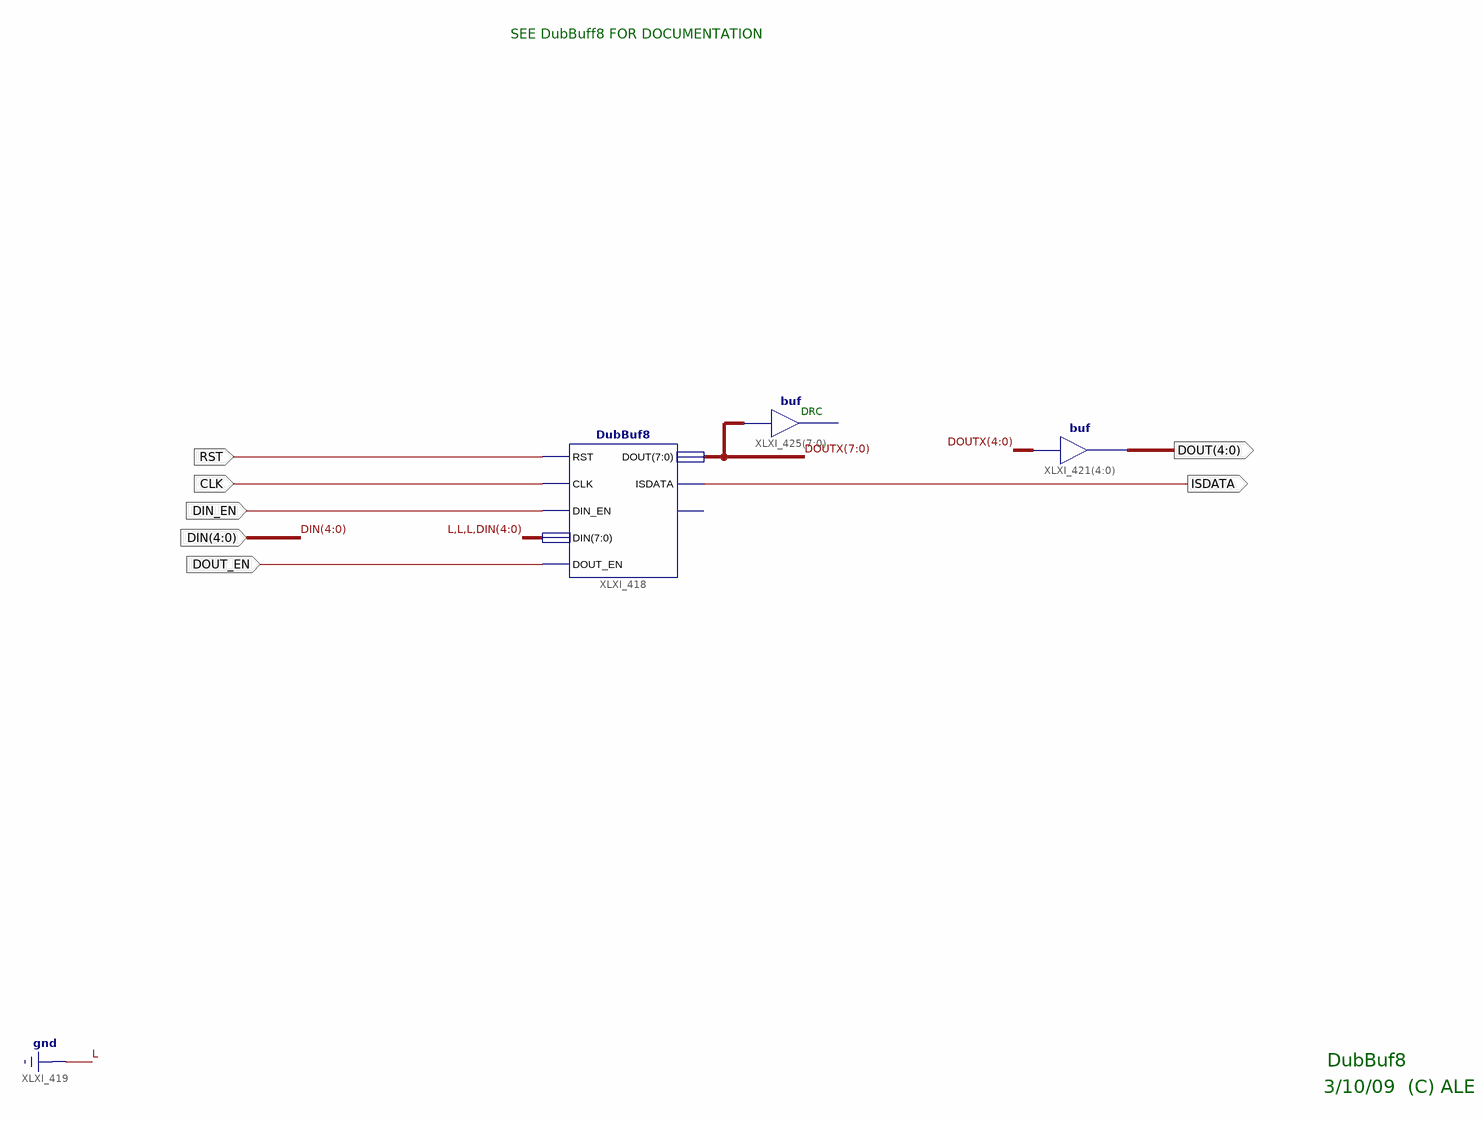
[diagram p0: schematic sheet 1]
// Xilinx ISE schematic DubBuf5.sch (spartan6) as structural Verilog: 3 symbols, 7 ports
module DubBuf5 (
  input  RST,
  input  CLK,
  input  DIN_EN,
  input  [4:0] DIN,
  input  DOUT_EN,
  output ISDATA,
  output [4:0] DOUT
);

  wire [7:0] DOUTX;

  assign DOUT = DOUTX[4:0];  // buf XLXI_421[4..0], 5 bits wide
  // buf XLXI_425[7..0] has open pins: I=DOUTX, O=open
  DubBuf8 XLXI_418 (
    .CLK(CLK), .DIN({3'b000, DIN}), .DIN_EN(DIN_EN), .DOUT(DOUTX), .DOUT_EN(DOUT_EN), .ISDATA(ISDATA),
    .RST(RST));  // open: OVERFLOW

  // Notes on the sheet:
  //   SEE DubBuff8 FOR DOCUMENTATION
  //   DRC
  //   DubBuf8
  //   3/10/09  (C) ALE
endmodule
